# EAGLE design pi-dmx (EAGLE 7.3.0)

## Sheet 1 of 6
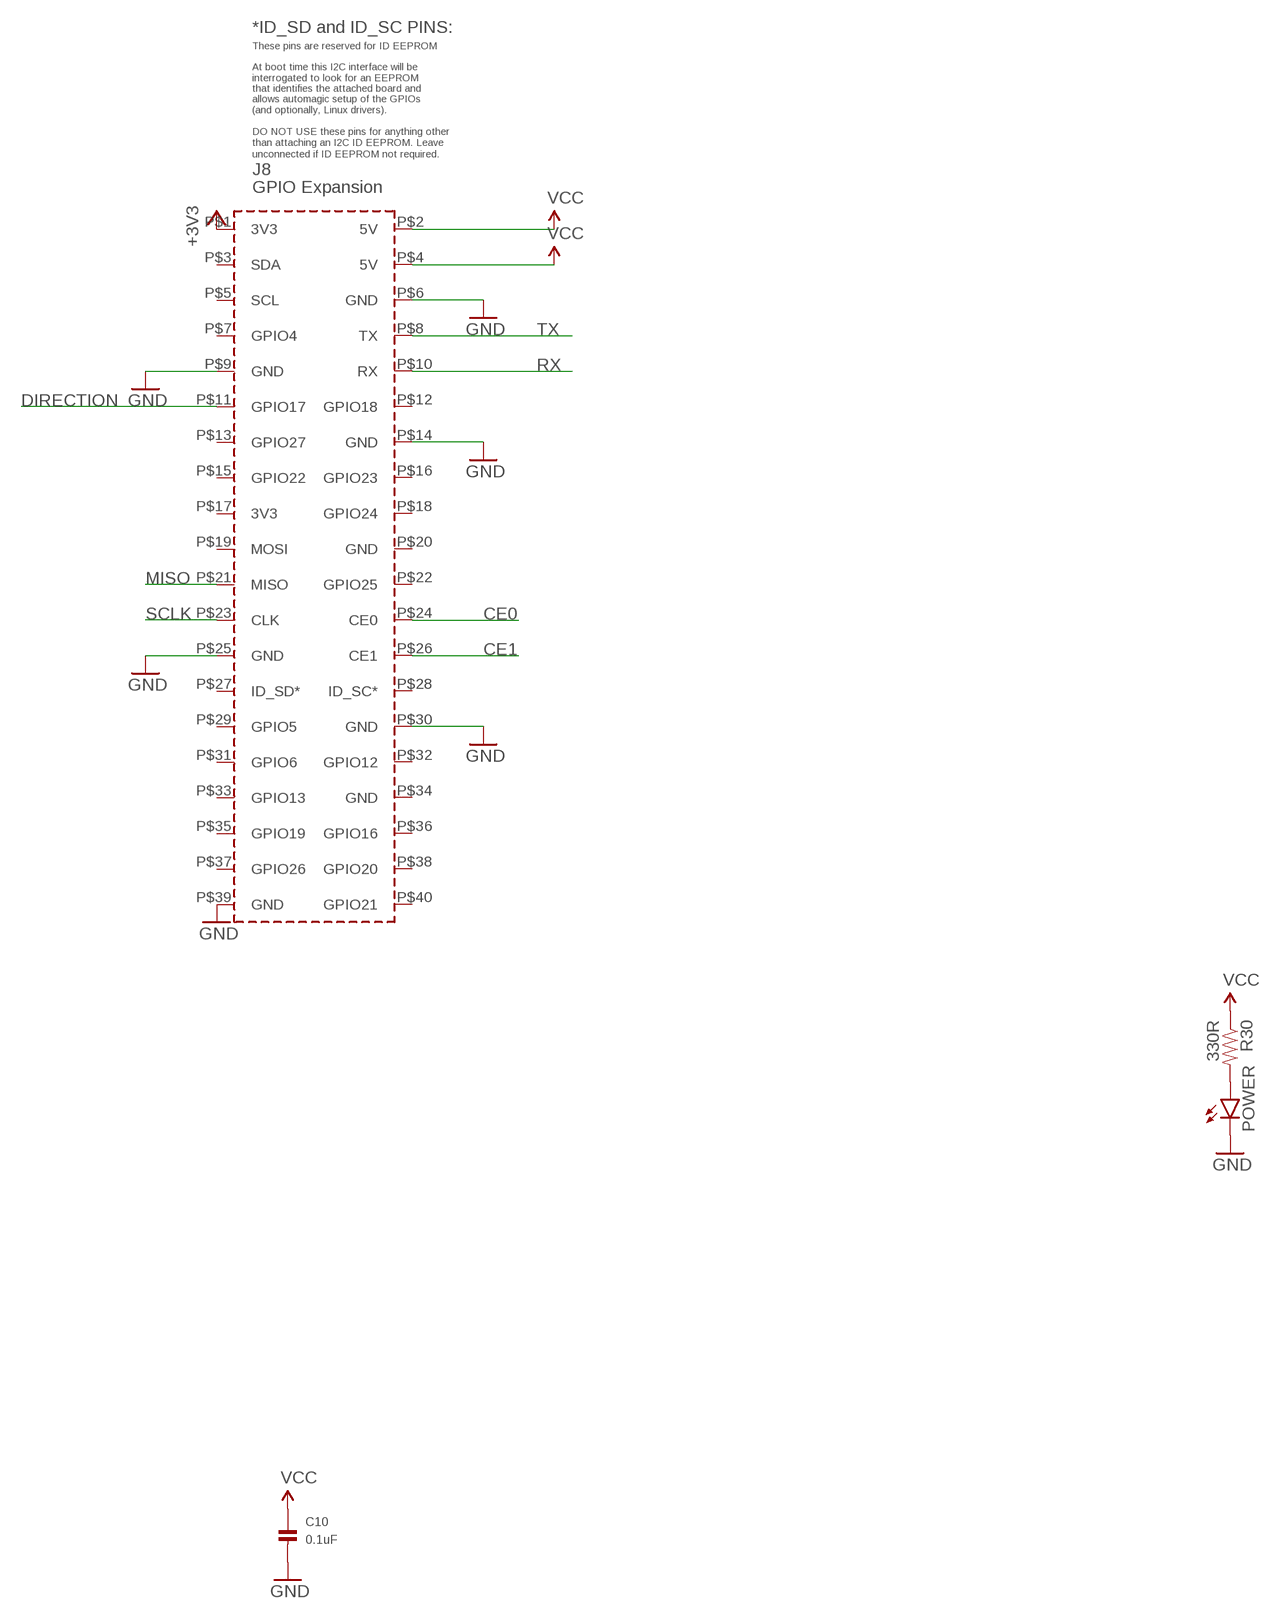
[diagram p0: schematic, sheet 1]

### Parts
C10  0.1uF  CAP_CERAMIC0805  [0805]
PCB1  RPI2  [RPI2]
POWER  LED1206  [LED-1206]
R30  330R  RESISTOR0603-RES  [0603-RES]

### Nets
+3V3: PCB1.P$1(3V3) ; also sheet 4
CE0: PCB1.P$24(CE0) ; also sheet 6
CE1: PCB1.P$26(CE1) ; also sheet 6
DIRECTION: PCB1.P$11(GPIO17) ; also sheet 4
GND: C10.2 PCB1.P$6(GND) PCB1.P$9(GND) PCB1.P$14(GND) PCB1.P$25(GND) PCB1.P$30(GND) PCB1.P$39(GND) POWER.C ; also sheet 2,4,6
MISO: PCB1.P$21(MISO) ; also sheet 6
N$30: POWER.A R30.2
RX: PCB1.P$10(RX) ; also sheet 4
SCLK: PCB1.P$23(CLK) ; also sheet 6
TX: PCB1.P$8(TX) ; also sheet 4
VCC: C10.1 PCB1.P$2(5V) PCB1.P$4(5V) R30.1 ; also sheet 2,4,6
Unconnected: PCB1.P$3(SDA) PCB1.P$5(SCL) PCB1.P$7(GPIO4) PCB1.P$12(GPIO18) PCB1.P$13(GPIO27) PCB1.P$15(GPIO22) PCB1.P$16(GPIO23) PCB1.P$17(3V3) PCB1.P$18(GPIO24) PCB1.P$19(MOSI) PCB1.P$20(GND) PCB1.P$22(GPIO25) PCB1.P$27(ID_SD*) PCB1.P$28(ID_SC*) PCB1.P$29(GPIO5) PCB1.P$31(GPIO6) PCB1.P$32(GPIO12) PCB1.P$33(GPIO13) PCB1.P$34(GND) PCB1.P$35(GPIO19) PCB1.P$36(GPIO16) PCB1.P$37(GPIO26) PCB1.P$38(GPIO20) PCB1.P$40(GPIO21)

## Sheet 2 of 6
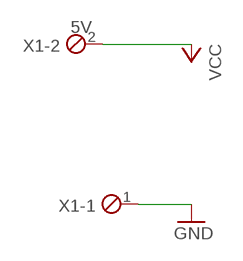
[diagram p1: schematic, sheet 2]

### Parts
X1  5V  MPT2  [2POL254]

### Nets
GND: X1.1 ; also sheet 1,4,6
VCC: X1.2 ; also sheet 1,4,6

## Sheet 3 of 6

## Sheet 4 of 6
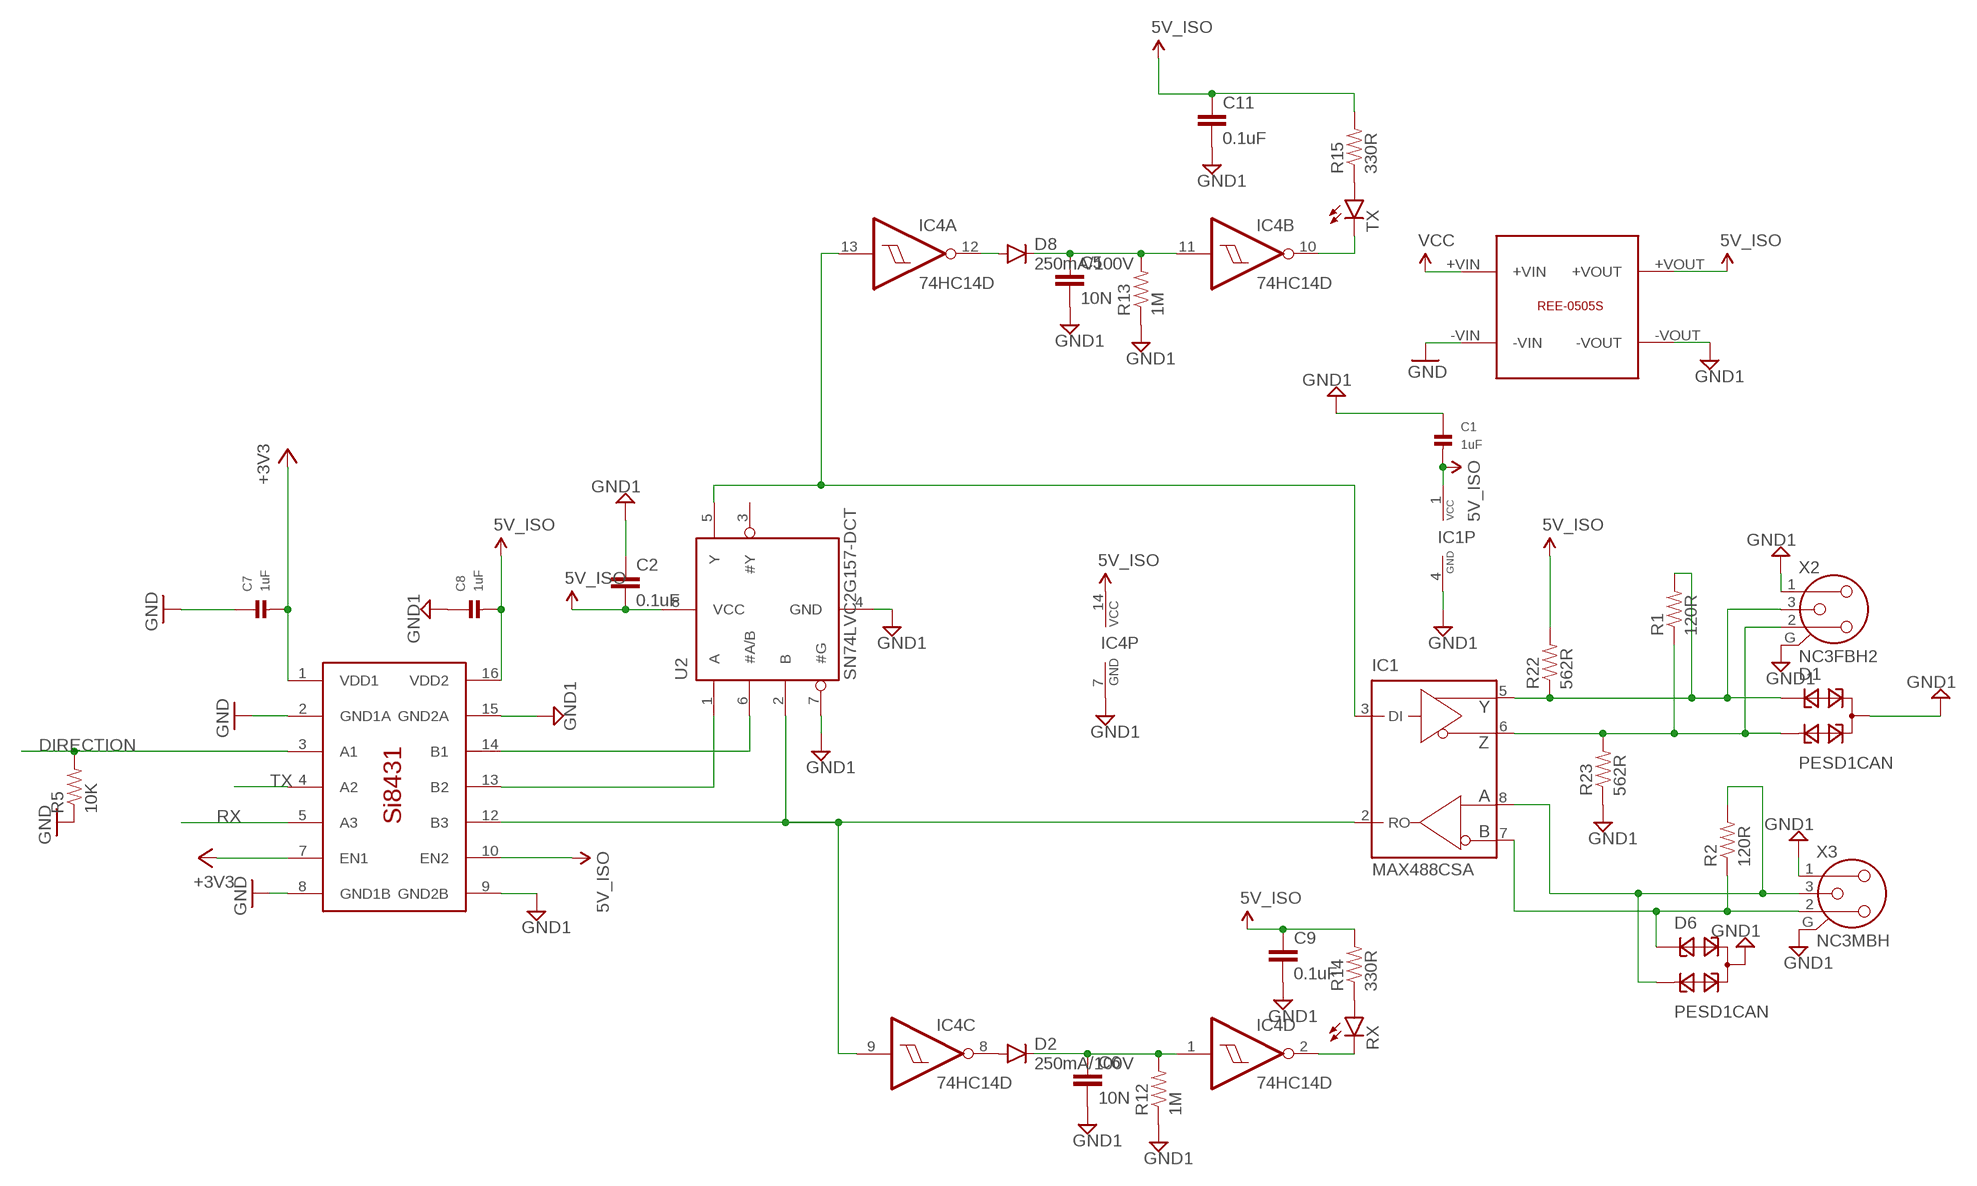
[diagram p2: schematic, sheet 4]

### Parts
C1  1uF  CAP_CERAMIC0805  [0805]
C2  0.1uF  CAP0603-CAP  [0603-CAP]
C5  10N  CAP0603-CAP  [0603-CAP]
C6  10N  CAP0603-CAP  [0603-CAP]
C7  1uF  CAP_CERAMIC0805  [0805]
C8  1uF  CAP_CERAMIC0805  [0805]
C9  0.1uF  CAP0603-CAP  [0603-CAP]
C11  0.1uF  CAP0603-CAP  [0603-CAP]
D1  PESD1CAN  [SOT23]
D2  250mA/100V  DIODEBAS16  [SOD-323]
D6  PESD1CAN  [SOT23]
D8  250mA/100V  DIODEBAS16  [SOD-323]
IC1  MAX488CSA  [SO08]
IC4  74HC14D  [SO14]
R1  120R  RESISTOR1206  [1206]
R2  120R  RESISTOR1206  [1206]
R5  10K  RESISTOR0603-RES  [0603-RES]
R12  1M  RESISTOR0603-RES  [0603-RES]
R13  1M  RESISTOR0603-RES  [0603-RES]
R14  330R  RESISTOR0603-RES  [0603-RES]
R15  330R  RESISTOR0603-RES  [0603-RES]
R22  562R  RESISTOR0603-RES  [0603-RES]
R23  562R  RESISTOR0603-RES  [0603-RES]
RX  LED1206  [LED-1206]
TX  LED1206  [LED-1206]
U2  SN74LVC2G157-DCT  [SSOP8]
U$6  REE-0505S  [REE-0505S]
U$8  SI8431  [SO16]
X2  NC3FBH2  [NC3FBH2]
X3  NC3MBH  [NC3MBH]

### Nets
5V: C1.2 C2.2 C8.2 C9.1 C11.1 IC1.1(VCC) IC4.14(P:VCC) R14.2 R15.2 R22.2 U2.8(VCC) U$6.+VOUT U$8.10(EN2) U$8.16(VDD2) ; supply symbol labelled 5V_ISO
+3V3: C7.2 U$8.1(VDD1) U$8.7(EN1) ; also sheet 1
DIRECTION: R5.2 U$8.3(A1) ; also sheet 1
GND: C7.1 R5.1 U$6.-VIN U$8.2(GND1A) U$8.8(GND1B) ; also sheet 1,2,6
GND1: C1.1 C2.1 C5.2 C6.2 C8.1 C9.2 C11.2 D1.3 D6.3 IC1.4(GND) IC4.7(P:GND) R12.1 R13.1 R23.1 U2.4(GND) U2.7(#G) U$6.-VOUT U$8.9(GND2B) U$8.15(GND2A) X2.1 X2.G X3.1 X3.G
N$1: D2.A IC4.8(C:O)
N$2: D8.A IC4.12(A:O)
N$3: D6.1 IC1.7(B) R2.1 X3.2
N$4: U2.6(#A/B) U$8.14(B1)
N$5: U2.1(A) U$8.13(B2)
N$6: D6.2 IC1.8(A) R2.2 X3.3
N$8: IC1.3(DI) IC4.13(A:I) U2.5(Y)
N$10: C5.1 D8.C IC4.11(B:I) R13.2
N$21: C6.1 D2.C IC4.1(D:I) R12.2
N$22: D1.1 IC1.5(Y) R1.2 R22.1 X2.3
N$23: D1.2 IC1.6(Z) R1.1 R23.2 X2.2
N$24: R14.1 RX.A
N$25: IC4.2(D:O) RX.C
N$26: R15.1 TX.A
N$27: IC4.10(B:O) TX.C
N$28: IC1.2(RO) IC4.9(C:I) U2.2(B) U$8.12(B3)
RX: U$8.5(A3) ; also sheet 1
TX: U$8.4(A2) ; also sheet 1
VCC: U$6.+VIN ; also sheet 1,2,6
Unconnected: IC4.3(E:I) IC4.4(E:O) IC4.5(F:I) IC4.6(F:O) U2.3(#Y)

## Sheet 5 of 6

## Sheet 6 of 6
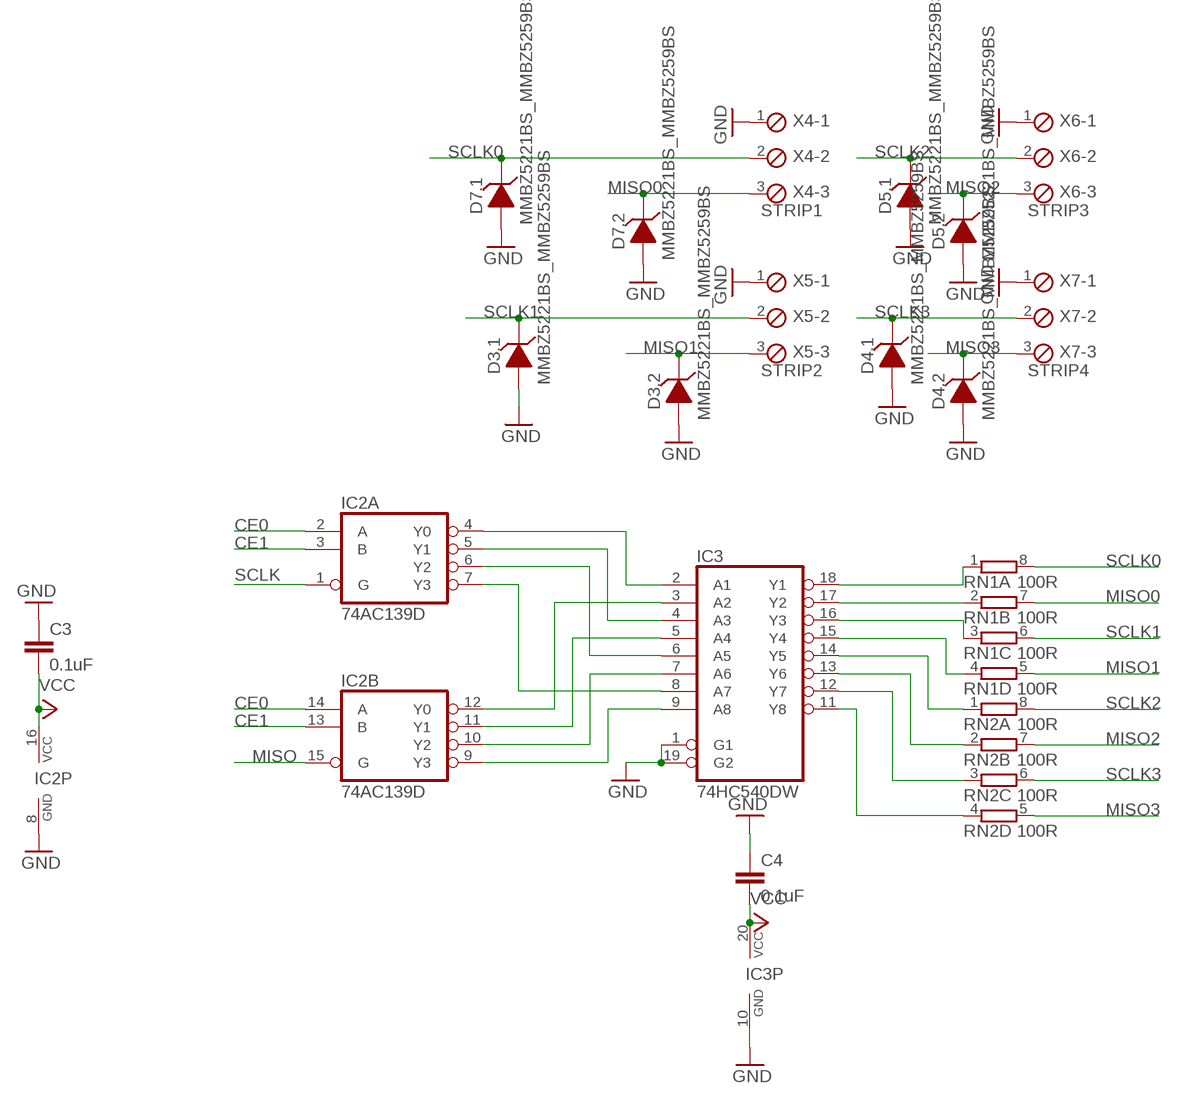
[diagram p3: schematic, sheet 6]

### Parts
C3  0.1uF  CAP0603-CAP  [0603-CAP]
C4  0.1uF  CAP0603-CAP  [0603-CAP]
D3  MMBZ5221BS_MMBZ5259BS  [SOT363_PHILIPS]
D4  MMBZ5221BS_MMBZ5259BS  [SOT363_PHILIPS]
D5  MMBZ5221BS_MMBZ5259BS  [SOT363_PHILIPS]
D7  MMBZ5221BS_MMBZ5259BS  [SOT363_PHILIPS]
IC2  74AC139D  [SO16]
IC3  74HC540DW  [SO20W]
RN1  100R  4R-NEXBS8V  [EXBS8V]
RN2  100R  4R-NEXBS8V  [EXBS8V]
X4  STRIP1  MPT3  [3POL254]
X5  STRIP2  MPT3  [3POL254]
X6  STRIP3  MPT3  [3POL254]
X7  STRIP4  MPT3  [3POL254]

### Nets
CE0: IC2.2(A:A) IC2.14(B:A) ; also sheet 1
CE1: IC2.3(A:B) IC2.13(B:B) ; also sheet 1
GND: C3.1 C4.1 D3.1(.1:A) D3.4(.2:A) D4.1(.1:A) D4.4(.2:A) D5.1(.1:A) D5.4(.2:A) D7.1(.1:A) D7.4(.2:A) IC2.8(P:GND) IC3.1(G1) IC3.10(GND) IC3.19(G2) X4.1 X5.1 X6.1 X7.1 ; also sheet 1,2,4
MISO: IC2.15(B:G) ; also sheet 1
MISO0: D7.3(.2:C) RN1.7 X4.3
MISO1: D3.3(.2:C) RN1.5 X5.3
MISO2: D5.3(.2:C) RN2.7 X6.3
MISO3: D4.3(.2:C) RN2.5 X7.3
N$7: IC3.17(Y2) RN1.2
N$9: IC3.18(Y1) RN1.1
N$11: IC3.16(Y3) RN1.3
N$12: IC3.15(Y4) RN1.4
N$13: IC2.4(A:Y0) IC3.2(A1)
N$14: IC2.5(A:Y1) IC3.4(A3)
N$15: IC2.6(A:Y2) IC3.6(A5)
N$16: IC2.7(A:Y3) IC3.8(A7)
N$17: IC2.12(B:Y0) IC3.3(A2)
N$18: IC2.11(B:Y1) IC3.5(A4)
N$19: IC2.10(B:Y2) IC3.7(A6)
N$20: IC2.9(B:Y3) IC3.9(A8)
N$32: IC3.14(Y5) RN2.1
N$33: IC3.13(Y6) RN2.2
N$34: IC3.12(Y7) RN2.3
N$35: IC3.11(Y8) RN2.4
SCLK: IC2.1(A:G) ; also sheet 1
SCLK0: D7.6(.1:C) RN1.8 X4.2
SCLK1: D3.6(.1:C) RN1.6 X5.2
SCLK2: D5.6(.1:C) RN2.8 X6.2
SCLK3: D4.6(.1:C) RN2.6 X7.2
VCC: C3.2 C4.2 IC2.16(P:VCC) IC3.20(VCC) ; also sheet 1,2,4

## Library data of the parts
C1 C7 C8 C10 = microbuilder:CAP_CERAMIC: Ceramic Capacitors 0402 - 0402 Surface Mount Capacitors 16pF 50V 5% [Digikey: 445-4899-2-ND] 18pF 50V 5% [Digikey: 490-1281-2-ND] 22pF 50V 5% [Digikey: 490-1283-2-ND] 68pF 50V 5% [Digikey: 490-1289-2-ND] 0.1uF 10V 10% [Digikey: 490-1318-2-ND] 1.0uF 6.3V 10% [Digikey: 490-1320-2-ND] 0603 - 0603 Surface Mount Capacitors 16 pF 50V 5% [Digikey: 445-5051-2-ND] 22 pF 50V [Digikey: PCC220ACVTR-ND] 33 pF 50V 5% [Digikey: 490-1415-1-ND] 56pF 50V 5% [Digikey: 490-1421-1-ND] 220pF 50V 5% [Digikey: 445-1285-1-ND] 680 pF 50V 2200 pF 50V 5% C0G [Digikey: 445-1297-1-ND] 5600 pF 100V 5% X7R [Digikey: 478-3711-1-ND] 0.1 µF 25V 10% [Digikey: PCC2277TR-ND] 0.22 µF 16V 10% X7R [Digikey: 445-1318-1-ND] 1.0 µF 25V 10% [Digikey: 445-5146-2-ND] 0603 - RF Specific 3pF 250V +/-0.1pF RF [Digikey: 712-1347-1-ND] 18 pF 250V 5% [Digikey: 478-3505-1-ND or 712-1322-1-ND] 56 pF 250V 5% C0G RF [Digikey: 490-4867-1-ND] 68 pF 250V RF [Digikey: 490-4868-1-ND] 0805 - 0805 Surface Mount Capacitors 220 pF 250V 2% RF Ceramic Capacitor [Digikey: 712-1398-1-ND] 1000 pF 50V 2% NP0 Ceramic Capacitor [Digikey: 478-3760-1-ND] 0.1 µF 25V 10% Ceramic Capacitor [Digikey: PCC1828TR-ND] 1.0 µF 16V 10% Ceramic Capacitor[Digikey: 490-1691-2-ND] 10.0 µF 10V 10% Ceramic Capacitor[Digikey: 709-1228-1-ND] 10.0 uF 16V 10% Ceramic Capacitor [Digikey: 478-5165-2-ND] 47 uF 6.3V 20% Ceramic Capacitor [Digikey: 587-1779-1-ND or 399-5506-1-ND] 1206 - 1206 Surface Mount Capacitors 47uF 10V 20% Ceramic Capacitor [Digikey: 490-5528-1-ND or 399-5508-1-ND or 445-6010-1-ND] 100uF 6.3V -20%, +80% Y5V Ceramic Capacitor (Digikey: 490-4512-1-ND, Mouser: 81-GRM31CF50J107ZE1L)
C2 = SparkFun-Passives:CAP: Capacitor Standard 0603 ceramic capacitor, and 0.1" leaded capacitor.
C3-C6 C9 C11 = SparkFun-Capacitors:CAP: Capacitor Standard 0603 ceramic capacitor, and 0.1" leaded capacitor.
D1 D6 = diode:PESD1CAN: CAN bus ESD protection diode Source: http://www.nxp.com/documents/data_sheet/PESD1CAN.pdf
D2 D8 = SparkFun-DiscreteSemi:DIODE: Diode These are standard reverse protection diodes and small signal diodes. SMA package can handle up to about 1A. SOD-323 can handle about 200mA. What the SOD-323 package when ordering, there are some mfgs out there that are 5-pin packages.; PROD_ID: DIO-09646
D3-D5 D7 = m-pad-2.1:MMBZ5221BS_MMBZ5259BS: Diodes Inc MMBZ5221BS - MMBZ5259BS 200mW SURFACE MOUNT ZENER DIODE Features: Planar Die Construction Dual Isolated Zeners in Ultra-Small Surface Mount Package Ideally Suited for Automated Assembly Processes Available in Lead Free/RoHS Compliant Version (Note 5) Please send any comments to: messi@users.sourceforge.net
IC1 = maxim:MAX488: RS485 TRANSEIVER Source: Data sheet <http://datasheets.maxim-ic.com/en/ds/MAX1487-MAX491.pdf>; MF: MAXIM; MPN: MAX488CSA; OC_FARNELL: 3534170; OC_NEWARK: 34C3921
IC2 = 74xx-eu:74*139: Dual 2-line to 4-line DECODER/DEMULTIPLEXER
IC3 = 74xx-eu:74*540: Octal BUFFER and LINE DRIVER, 3-state
IC4 = 74xx-eu:74*14: Hex schmitt trigger INVERTER
PCB1 = e14_Rpi2_RevA:RPI2: Device for Raspberry Pi 2 board created by www.element14.com More information and support community is available at http://www.element14.com/community/community/raspberry-pi/raspberrypi2
POWER RX TX = SparkFun-LED:LED: LEDs Standard schematic elements and footprints for 5mm, 3mm, 1206, and 0603 sized LEDs. 5mm - Spark Fun Electronics SKU : COM-00529 (and others)
R1 R2 R12-R15 = SparkFun-Resistors:RESISTOR: Resistor Basic schematic elements and footprints for 0603, 1206, and PTH resistors.
R5 R22 R23 R30 = SparkFun-Passives:RESISTOR: Resistor Basic schematic elements and footprints for 0603, 1206, and PTH resistors.
RN1 RN2 = resistor-dil:4R-N: Array Chip Resistor Source: RS Component / Phycomp; OC_FARNELL: unknown; OC_NEWARK: unknown
U2 = m-pad-2.1:SN74LVC2G157: Ti's SN74LVC2G157 SINGLE 2-LINE TO 1-LINE DATA SELECTOR/MULTIPLEXER Description: This single 2-line to 1-line data selector/multiplexer is designed for 1.65-V to 5.5-V VCC operation. The SN74LVC2G157 features a common strobe (G) input. When the strobe is high, Y is low and Y is high. When the strobe is low, a single bit is selected from one of two sources and is routed to the outputs. The device provides true and complementary data. NanoStar and NanoFree package technology is a major breakthrough in IC packaging concepts, using the die as the package. This device is fully specified for partial-power-down applications using Ioff. The Ioff circuitry disables the outputs, preventing damaging current backflow through the device when it is powered down. Features: Available in the Texas Instruments NanoStar and NanoFree Packages Supports 5-V VCC Operation Inputs Accept Voltages to 5.5 V Max tpd of 6 ns at 3.3 V Low Power Consumption, 10-uA Max ICC ±24-mA Output Drive at 3.3 V Typical VOLP (Output Ground Bounce) less then 0.8 V at VCC = 3.3 V, TA = 25°C Typical VOHV (Output VOH Undershoot) greater then 2 V at VCC = 3.3 V, TA = 25°C Ioff Supports Partial-Power-Down Mode Operation Latch-Up Performance Exceeds 100 mA Per JESD 78, Class II ESD Protection Exceeds JESD 22 - 2000-V Human-Body Model (A114-A) - 1000-V Charged-Device Model (C101) Please send any comments to: messi@users.sourceforge.net
U$6 = grant:REE-0505S
U$8 = smd-footprints:SI8431
X1 = con-phoenix-254:MPT2: PHOENIX CONNECTOR; OC_FARNELL: unknown; OC_NEWARK: unknown
X2 = con-neutrik_ag:NC3: Neutrik Audio Connector XLR SERIES Stereo 1/4" jack Source: www.neutrik.com/; MPN: NC3FBH2; OC_FARNELL: unknown; OC_NEWARK: 27B4226
X3 = con-neutrik_ag:NC3: Neutrik Audio Connector XLR SERIES Stereo 1/4" jack Source: www.neutrik.com/; MF: NEUTRIK; MPN: NC3MBH; OC_FARNELL: unknown; OC_NEWARK: 91F3470
X4-X7 = con-phoenix-254:MPT3: PHOENIX CONNECTOR; OC_FARNELL: unknown; OC_NEWARK: unknown

## Board
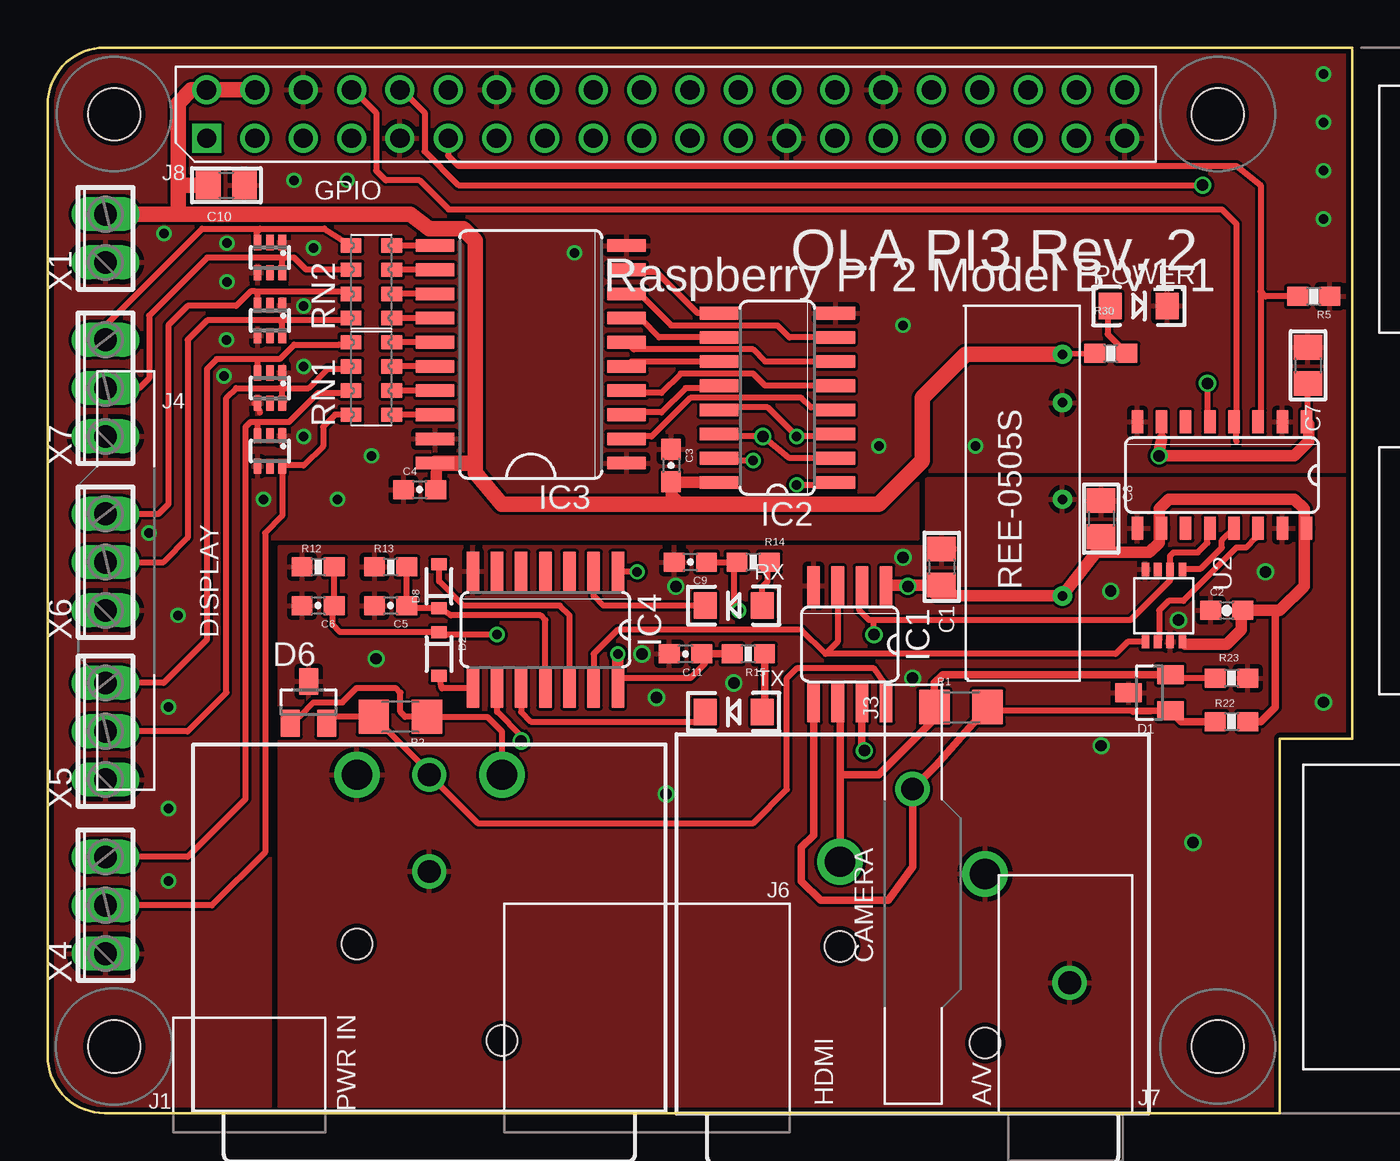
[diagram p4: board, top side]
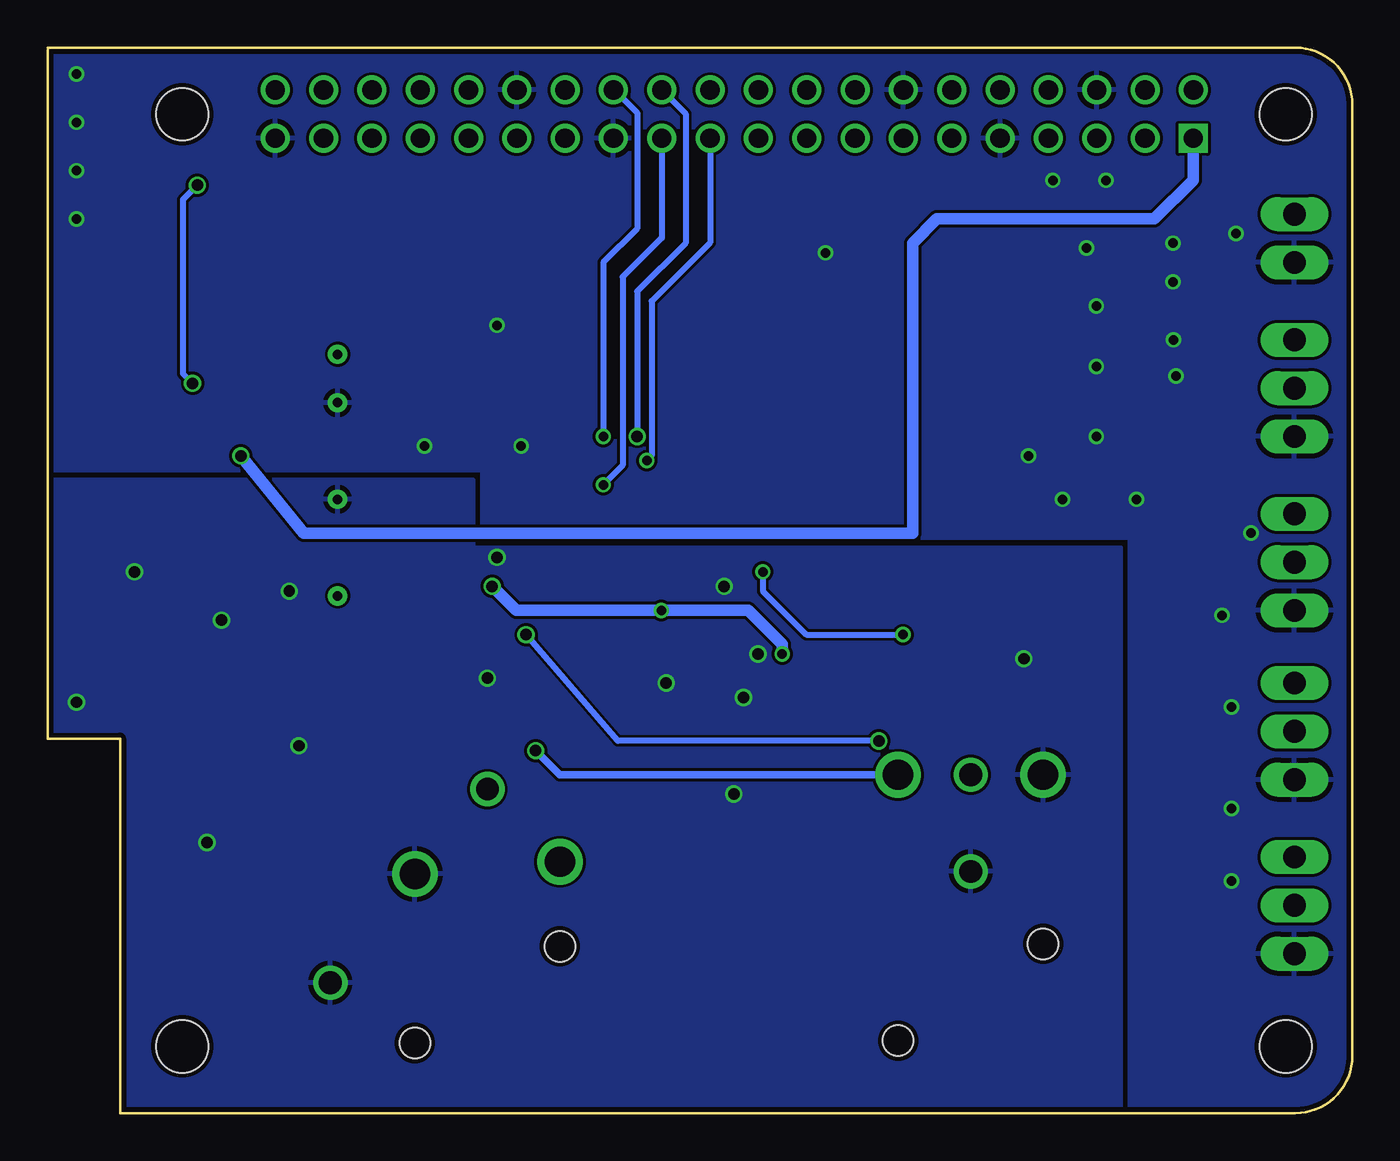
[diagram p5: board, bottom side, seen from below]

Size 68.58 x 56 mm. Coordinates in mm from the lower left corner, seen from the top.
Copper layers (1*16): Top 0.035mm / dielectric 1.5mm / Bottom 0.035mm
Design rules "SeeedStudio_2layer_DRU_no_angle_20140221": minimum track width 6mil, minimum drill 12mil, track to track 6mil, track to pad 6mil, pad to pad 6mil, via to via 6mil, smd to smd 0mil, copper to edge 10mil, drill to drill 10mil, minimum pad ring 10mil, minimum via ring 6mil, stop-mask expansion 2mil, vias tented up to drill 100mil, thermal gap 10mil

### Footprints (pad centres in the part's own frame; a part is rotated, then mirrored left to right if it is on the bottom)
0805 = smd 1.3 x 1.5: 1 -0.95,0; 2 0.95,0
0603-CAP = smd 1.1 x 1: 1 -0.85,0; 2 0.85,0
SOT23 = smd 1 x 1.4: 1 -0.95,-1.1; 2 0.95,-1.1; 3 0,1.1
SOD-323 = smd 0.63 x 0.83: A 1.15,0; C -1.15,0
SOT363_PHILIPS = smd 0.4 x 0.8: 1 -0.65,-0.8; 2 0,-0.8; 3 0.65,-0.8; 4 0.65,0.8; 5 0,0.8; 6 -0.65,0.8
SO08 = smd 0.66 x 2.032: 1 -1.905,-3.073; 2 -0.635,-3.073; 3 0.635,-3.073; 4 1.905,-3.073; 5 1.905,3.073; 6 0.635,3.073; 7 -0.635,3.073; 8 -1.905,3.073
SO16 = smd 0.66 x 2.032: 1 -4.445,-3.073; 2 -3.175,-3.073; 3 -1.905,-3.073; 4 -0.635,-3.073; 5 0.635,-3.073; 6 1.905,-3.073; 7 3.175,-3.073; 8 4.445,-3.073; 9 4.445,3.073; 10 3.175,3.073; 11 1.905,3.073; 12 0.635,3.073; 13 -0.635,3.073; 14 -1.905,3.073; 15 -3.175,3.073; 16 -4.445,3.073
SO20W = smd 0.66 x 2.032: 1 -5.715,-5.029; 2 -4.445,-5.029; 3 -3.175,-5.029; 4 -1.905,-5.029; 5 -0.635,-5.029; 6 0.635,-5.029; 7 1.905,-5.029; 8 3.175,-5.029; 9 4.445,-5.029; 10 5.715,-5.029; 11 5.715,5.029; 12 4.445,5.029; 13 3.175,5.029; 14 1.905,5.029; 15 0.635,5.029; 16 -0.635,5.029; 17 -1.905,5.029; 18 -3.175,5.029; 19 -4.445,5.029; 20 -5.715,5.029
SO14 = smd 0.66 x 2.032: 1 -3.81,-3.073; 2 -2.54,-3.073; 3 -1.27,-3.073; 4 0,-3.073; 5 1.27,-3.073; 6 2.54,-3.073; 7 3.81,-3.073; 8 3.81,3.073; 9 2.54,3.073; 10 1.27,3.073; 11 0,3.073; 12 -1.27,3.073; 13 -2.54,3.073; 14 -3.81,3.073
RPI2 = drill 1.016 square: P$1 8.37,51.23 | drill 1.016: P$2 8.357,53.772; P$3 10.897,51.232; P$4 10.897,53.772; P$5 13.437,51.232; P$6 13.437,53.772; P$7 15.977,51.232; P$8 15.977,53.772; P$9 18.517,51.232; P$10 18.517,53.772; P$11 21.057,51.232; P$12 21.057,53.772; P$13 23.597,51.232; P$14 23.597,53.772; P$15 26.137,51.232; P$16 26.137,53.772; P$17 28.677,51.232; P$18 28.677,53.772; P$19 31.217,51.232; P$20 31.217,53.772; P$21 33.757,51.232; P$22 33.757,53.772; P$23 36.297,51.232; P$24 36.297,53.772; P$25 38.837,51.232; P$26 38.837,53.772; P$27 41.377,51.232; P$28 41.377,53.772; P$29 43.917,51.232; P$30 43.917,53.772; P$31 46.457,51.232; P$32 46.457,53.772; P$33 48.997,51.232; P$34 48.997,53.772; P$35 51.537,51.232; P$36 51.537,53.772; P$37 54.077,51.232; P$38 54.077,53.772; P$39 56.617,51.232; P$40 56.617,53.772 | hole 2.75: 3.5,3.5; 61.5,3.5; 3.5,52.5; 61.5,52.5
LED-1206 = smd 1.2 x 1.4: A -1.5,0; C 1.5,0
1206 = smd 1.6 x 1.8: 1 -1.4,0; 2 1.4,0
0603-RES = smd 1.1 x 1: 1 -0.85,0; 2 0.85,0
EXBS8V = smd 0.75 x 1.1: 1 -1.905,-1.07; 2 -0.635,-1.07; 3 0.635,-1.07; 4 1.905,-1.07; 5 1.905,1.07; 6 0.635,1.07; 7 -0.635,1.07; 8 -1.905,1.07
SSOP8 = smd 0.4 x 0.7: 1 -0.975,-1.9; 2 -0.325,-1.9; 3 0.325,-1.9; 4 0.975,-1.9; 5 0.975,1.9; 6 0.325,1.9; 7 -0.325,1.9; 8 -0.975,1.9
REE-0505S = drill 0.5: +VIN 2.54,5.08; +VOUT 15.24,5.08; -VIN 5.08,5.08; -VOUT 10.16,5.08
SO16' = smd 0.6 x 1.2: 1 -4.445,-2.8; 2 -3.175,-2.8; 3 -1.905,-2.8; 4 -0.635,-2.8; 5 0.635,-2.8; 6 1.905,-2.8; 7 3.175,-2.8; 8 4.445,-2.8; 9 4.445,2.8; 10 3.175,2.8; 11 1.905,2.8; 12 0.635,2.8; 13 -0.635,2.8; 14 -1.905,2.8; 15 -3.175,2.8; 16 -4.445,2.8
2POL254 = drill 1.2 long: 1 -1.27,0; 2 1.27,0
NC3FBH2 = drill 1.6: 1 -3.81,0.635; 2 3.81,0 | drill 1.2: 3 0.004,-3.822; G -8.25,6.355 | hole 1.6: -3.81,9.525; 3.81,4.445
NC3MBH = drill 1.6: 1 3.81,0; 2 -3.81,0 | drill 1.2: 3 0,0; G 0,5.08 | hole 1.6: -3.81,13.97; 3.81,8.89
3POL254 = drill 1.2 long: 1 -2.54,0; 2 0,0; 3 2.54,0

### Placement (x,y rotation side)
C1  46.99,28.7 270 top
C2  61.98,26.42 0 top
C3  32.77,34.04 270 top
C4  19.56,32.77 0 top
C5  18.03,26.67 180 top
C6  14.22,26.67 180 top
C7  66.24,39.29 270 top
C8  55.37,31.24 270 top
C9  33.78,28.96 180 top
C10  9.4,48.77 0 top
C11  33.53,24.13 180 top
D1  57.91,22.1 90 top
D2  20.57,24.13 270 top
D3  11.68,38.1 180 top
D4  11.68,44.96 180 top
D5  11.68,41.66 180 top
D6  13.72,21.59 0 top
D7  11.68,34.8 180 top
D8  20.57,27.69 90 top
IC1  42.16,24.64 180 top
IC2  38.35,37.59 90 top
IC3  25.4,39.88 90 top
IC4  26.16,25.4 180 top
PCB1  0,0 0 top
POWER  57.35,42.42 0 top
R1  48.01,21.34 0 top
R2  18.54,20.83 180 top
R5  66.55,42.93 180 top
R12  14.22,28.7 0 top
R13  18.03,28.7 0 top
R14  37.08,28.96 180 top
R15  36.83,24.13 180 top
R22  62.23,20.57 0 top
R23  62.23,22.86 180 top
R30  55.88,39.93 0 top
RN1  17.02,38.61 90 top
RN2  17.02,43.69 90 top
RX  36.07,26.67 180 top
TX  36.07,21.08 180 top
U2  58.67,26.67 180 top
U$6  48.26,42.42 270 top
U$8  SI8431  [SO16']  61.72,33.53 180 top
X1  3.05,45.97 90 top
X2  45.47,13.21 180 top
X3  20.07,17.78 180 top
X4  3.05,10.92 90 top
X5  3.05,20.07 90 top
X6  3.05,28.96 90 top
X7  3.05,38.1 90 top

### Tracks (layer width: path | path; a pad name or v marks a point on that pad's centre or on a via)
5V  (via drill 0.5, 0.6)
  Top 0.305: IC1.1 44.07,28.57 | 59.78,24.64 U2.8 | v45.21,27.69 44.77,27.69 44.7,27.75 | R14.2 36.07,28.96 | C9.1 36.07,28.96 | 36.07,28.96 36.07,26.67 v36.32,26.42 | 34.54,24.13 34.54,23.62 33.78,22.86 29.97,22.86
  Top 0.406: R22.2 63.75,20.57 64.52,21.34 64.52,26.16 64.77,26.42 | C11.1 34.54,24.13 R15.2
  Top 0.61: C8.2 55.12,29.46 | 58.42,30.6 U$8.10 | 58.42,30.6 58.42,31.75 58.93,32.26 65.53,32.26 66.04,31.75 66.04,30.86 | 66.04,30.86 U$8.16 | 55.12,29.46 U$6.+VOUT 46.74,27.18 46.23,27.69 C1.2 44.7,27.75 44.11,27.75 IC1.1 | 58.42,30.6 58.42,29.97 57.91,29.46 55.12,29.46 | 59.78,24.64 61.98,24.64 62.74,25.4 62.74,26.33 C2.2 64.77,26.42 66.04,27.69 66.04,30.86 | v29.97,24.13 29.97,22.86 IC4.14
  Bottom 0.61: v45.21,27.69 43.94,26.42 v36.32,26.42 31.75,26.42 29.97,24.64 v29.97,24.13
+3V3  (via drill 0.6)
  Top 0.305: U$8.7 58.55,35.43 v58.42,34.54 | 66.29,36.2 U$8.1 66.18,36.31 C7.2
  Top 0.61: 66.29,36.2 66.29,35.31 65.53,34.54 v58.42,34.54 58.42,34.8 58.55,35.43
  Bottom 0.61: PCB1.P$1 8.37,49.03 10.41,46.99 21.84,46.99 23.11,45.72 23.11,30.48 55.12,30.48 v58.42,34.54
CE0  (via drill 0.6)
  Top 0.305: IC2.14 35.41,35.56 v37.59,35.56 38.99,34.42 IC2.2
  Bottom 0.305: PCB1.P$24 35.05,52.53 35.05,45.72 37.59,43.18 v37.59,35.56
CE1  (via drill 0.5)
  Top 0.305: IC2.3 41.3,35.56 v39.37,35.56 37.85,37.08 35.41,37.08 IC2.13
  Bottom 0.305: PCB1.P$26 38.79,53.77 37.59,52.58 37.59,46.48 39.37,44.7 v39.37,35.56
DIRECTION
  Top 0.305: PCB1.P$11 21.06,50.32 21.59,49.78 62.48,49.78 63.75,48.77 63.75,43.18 | 63.5,36.32 63.5,36.45 U$8.3 63.75,36.45 63.75,43.18 | R5.2 64.01,42.93 63.75,43.18
GND  (via drill 0.5)
  Top 0.305: D3.4 10.88,37.3 11.18,36.83
  other vias: 13.97,45.47 6.12,46.23 13.46,42.42 9.4,40.64 13.46,39.24 13.46,35.56 11.35,32.26 5.33,30.48 6.35,16 6.35,12.19 15.24,32.26 17.02,34.54 27.69,45.21 9.27,38.73 6.35,21.34 9.42,43.69 9.42,45.72 67.06,54.61 67.06,52.07 67.06,49.53 67.06,46.99 12.95,49.02 15.75,49.02 43.69,35.05 48.77,35.05 44.96,41.4 6.86,26.16
  pour Top: 0.25,0 11.68,0 11.68,30.23 45.72,30.23 45.72,33.78 68.83,33.78 68.83,55.88 0.25,55.88
  pour Bottom: 0.25,0 11.68,0 11.68,30.23 45.72,30.23 45.72,33.78 68.58,33.78 68.83,55.88 0.25,55.88
  pour Bottom: 0.25,0 11.68,0 11.68,30.23 45.72,30.23 45.72,33.78 68.58,33.78 68.83,55.88 0.25,55.88
  pour Bottom: 0.25,0 11.68,0 11.68,30.23 45.72,30.23 45.72,33.78 68.58,33.78 68.83,55.88 0.25,55.88
  pour Bottom: 0.25,0 11.68,0 11.68,30.23 45.72,30.23 45.72,33.78 68.58,33.78 68.83,55.88 0.25,55.88
GND1  (via drill 0.6)
  other vias: 32.51,16.76 45.47,22.86 55.37,19.3 55.88,27.43 67.06,21.59 60.2,14.22 44.96,29.21 64.01,28.45 59.44,25.91 17.27,23.88 33.02,27.69 32,21.84 31.24,24.13 36.07,22.61
  pour Top: 12.19,29.72 12.19,0 65.02,0 65.02,19.05 68.83,19.05 68.83,33.27 46.23,33.27 46.23,29.72
  pour Bottom: 12.19,29.72 12.19,0 65.02,0 65.02,19.05 68.83,19.05 68.83,33.27 46.23,33.27 46.23,29.72
MISO  (via drill 0.5)
  Top 0.305: v37.08,34.29 35.41,34.29 IC2.15
  Bottom 0.305: PCB1.P$21 33.76,45.74 36.83,42.67 36.83,34.54 v37.08,34.29
MISO0
  Top 0.305: 10.92,36.32 10.67,36.32 10.41,36.07 10.41,16.51 7.37,13.46 X4.3 | 10.92,36.32 12.7,36.32 14.22,37.85 15.31,37.85 RN1.7 | D7.3 11.03,36.21 10.92,36.32
MISO1
  Top 0.305: RN1.5 15.31,40.39 12.95,40.39 12.19,39.62 10.92,39.62 | 10.92,39.62 8.89,39.62 8.38,39.12 8.38,24.89 6.1,22.61 X5.3 | D3.3 11.03,39.51 10.92,39.62
MISO2
  Top 0.305: X6.3 5.84,31.5 6.35,32 6.35,41.4 7.37,42.42 9.91,42.42 10.67,43.18 10.92,43.18 | 10.92,43.18 15.31,43.18 RN2.7 | D5.3 11.03,43.07 10.92,43.18
MISO3
  Top 0.305: 11.18,46.48 8.13,46.48 3.05,41.4 X7.3 | 11.18,46.48 14.55,46.48 RN2.5 | D4.3 11,45.72 11,46.3 11.18,46.48
N$1
  Top 0.305: IC4.8 20.72,22.33 D2.A
N$2
  Top 0.305: D8.A 20.57,27.94 21.84,26.67 26.92,26.67 27.43,26.16 IC4.12
N$3  (via drill 0.6)
  Top 0.305: X3.2 23.88,20.07 23.11,20.83 R2.1 18.8,20.83 18.54,21.08 18.54,22.1 18.29,22.35 16.26,22.35 15.49,21.59 13.97,21.59 13.27,20.89 D6.1
  Top 0.406: IC1.7 42.8,19.18 v42.93,19.05
  Bottom 0.406: v42.93,19.05 41.66,17.78 X3.2
N$4
  Top 0.305: 63.75,30.6 U$8.14 63.5,30.6 63.5,30.23 62.99,29.72 62.48,29.72 59.69,26.92 58.93,26.92 58.42,26.42 58.42,24.84 U2.6
N$5
  Top 0.305: U2.1 59.69,28.61 60.62,28.61 61.72,29.72 61.72,30.09 U$8.13 62.48,30.6
N$6
  Top 0.305: 43.94,21.69 43.94,22.61 43.43,23.37 39.37,23.37 38.86,22.86 38.86,17.02 37.08,15.24 22.61,15.24 X3.3 20.07,17.9 R2.2 15,20.83 D6.2
  Top 0.406: 43.94,21.69 IC1.8
N$7
  Top 0.305: IC3.17 RN1.2
N$8
  Top 0.305: IC4.13 28.7,24.13 29.97,25.4 39.62,25.4 40.89,24.13 | U2.5 56.77,24.77 56.13,24.13 40.89,24.13 | IC1.3 41.53,24.77 40.89,24.13
N$9
  Top 0.305: IC3.18 RN1.1
N$10
  Top 0.305: R13.2 C5.1 19.02,26.54 D8.C 21.2,26.16 25.91,26.16 26.16,25.91 IC4.11
N$11
  Top 0.305: IC3.16 RN1.3
N$12
  Top 0.305: IC3.15 RN1.4
N$13
  Top 0.305: IC2.4 41.3,37.08 40.13,37.08 39.62,37.59 33.78,37.59 31.75,35.56 30.56,35.56 IC3.2 30.56,35.31
N$14
  Top 0.305: IC2.5 37.72,38.23 37.08,38.86 33.27,38.86 32.26,37.85 30.56,37.85 IC3.4
N$15
  Top 0.305: IC2.6 37.72,39.5 37.08,40.13 30.81,40.13 IC3.6
N$16
  Top 0.305: IC2.7 38.99,40.77 38.35,41.4 32.77,41.4 31.11,43.05 IC3.8
N$17
  Top 0.305: IC2.12 35.15,38.1 33.53,38.1 32.26,36.83 30.56,36.83 IC3.3 30.56,36.58
N$18
  Top 0.305: IC2.11 30.68,39.5 IC3.5
N$19
  Top 0.305: IC2.10 32.13,40.77 31.24,41.66 30.56,41.66 IC3.7
N$20
  Top 0.305: 30.56,44.45 IC3.9 30.56,44.2 32,44.2 34.16,42.04 IC2.9
N$21  (via drill 0.5)
  Top 0.305: IC4.1 30.96,28.47 v30.99,28.45 | v23.62,25.15 20.69,25.15 D2.C 15.36,25.28 14.99,25.65 14.99,26.58 C6.1 R12.2
  Bottom 0.305: v30.99,28.45 30.99,27.43 28.7,25.15 v23.62,25.15
N$22
  Top 0.305: 57.05,21.08 D1.1 49.59,21.15 R1.2
  Top 0.406: 40.13,21.69 IC1.5 40.26,14.61 39.62,13.97 39.62,12.19 40.64,11.18 44.2,11.18 45.47,12.95 X2.3 | 49.53,21.22 R1.2 49.22,21.15 46.68,18.25 X2.3 | X2.3 | R22.1 59.59,20.57 D1.1
N$23
  Top 0.305: R23.2 59.2,22.86 D1.2
  Top 0.406: 41.4,21.69 IC1.6 41.66,21.44 41.66,17.78 | 57,23.05 D1.2 47.05,23.05 46.61,22.61 R1.1 46.61,20.7 43.69,17.78 41.66,17.78 | X2.2 41.66,17.78
N$24
  Top 0.305: RX.A 37.57,27.66 37.85,27.94 37.85,29.12 R14.1
N$25
  Top 0.305: RX.C 29.21,26.67 28.7,27.18 IC4.2
N$26
  Top 0.406: TX.A 37.68,21.08 R15.1
N$27
  Top 0.305: IC4.10 24.89,21.08 25.4,20.57 34.06,20.57 TX.C
N$28  (via drill 0.6)
  Top 0.305: 43.43,25.91 56.9,25.91 59,28.01 U2.2 59,29.28 59.18,29.46 60.45,29.46 60.96,29.97 60.96,30.6 U$8.12 61.21,30.6 | 43.43,25.91 43.18,25.91 42.67,26.42 42.67,27.58 IC1.2 | v43.43,25.15 43.43,25.91 | v24.89,19.56 24.89,19.81 23.62,21.08 IC4.9
  Bottom 0.305: v24.89,19.56 38.61,19.56 v43.43,25.15
N$30
  Top 0.305: POWER.A 55.71,42.05 55.71,40.95 R30.2
N$32
  Top 0.305: IC3.14 RN2.1
N$33
  Top 0.305: IC3.13 RN2.2
N$34
  Top 0.305: IC3.12 RN2.3
N$35
  Top 0.305: IC3.11 RN2.4
RX  (via drill 0.6)
  Top 0.305: PCB1.P$10 18.62,53.77 19.81,52.58 19.81,50.55 21.59,48.77 v60.71,48.77 | v60.96,38.35 60.96,36.45 U$8.5
  Bottom 0.305: v60.71,48.77 61.47,48.01 61.47,38.86 v60.96,38.35
SCLK  (via drill 0.5)
  Top 0.305: v39.37,33.02 41.3,33.02 IC2.1
  Bottom 0.305: PCB1.P$23 36.3,46 38.35,43.94 38.35,34.04 v39.37,33.02
SCLK0
  Top 0.305: RN1.8 15.11,36.7 14.48,36.07 14.48,35.05 13.46,34.04 12.37,34.04 D7.6 12.33,31.38 11.43,30.48 11.43,13.72 8.64,10.92 X4.2
SCLK1
  Top 0.305: 12.19,38.1 9.91,38.1 9.4,37.59 9.4,22.1 7.37,20.07 X5.2 | 12.45,37.41 D3.6 | D3.6 12.33,37.96 12.19,38.1 | 12.37,37.34 D3.6 | 12.19,38.1 13.72,38.1 14.73,39.12 15.82,39.12 RN1.6
SCLK2
  Top 0.305: X6.2 6.1,28.96 7.37,30.23 7.37,40.64 8.38,41.66 12.19,41.66 | 12.19,41.66 15.82,41.66 RN2.8 | D5.6 12.33,41.51 12.19,41.66
SCLK3
  Top 0.305: X7.2 4.83,38.1 5.33,38.61 5.33,41.91 8.38,44.96 12.45,44.96 | RN2.6 13.59,44.32 12.95,44.96 12.45,44.96 | D4.6 12.33,44.85 12.45,44.96
TX
  Top 0.305: 62.48,36.45 U$8.4 62.48,36.2 | PCB1.P$8 16.08,53.77 17.27,52.58 17.27,49.53 17.78,49.02 19.56,49.02 21.08,47.5 61.72,47.5 62.48,46.74 62.48,36.2 | 62.48,35.31 62.48,36.2
VCC
  Top 0.305: U$6.+VIN 52.44,39.88 R30.1
  Top 0.61: C4.2 20.46,34.08 IC3.20 | IC2.16 32.78,33.15 | 32.78,33.15 C3.2 | 32.78,33.15 32.78,32.5 33.27,32
  Top 0.813: 6.86,48.77 6.86,53.09 7.54,53.77 PCB1.P$2 PCB1.P$4 | 6.86,48.77 6.86,47.24 | U$6.+VIN 48.26,39.88 45.97,37.59 45.97,34.29 43.69,32 33.27,32 23.88,32 22.48,33.66 22.48,34.16 | IC3.20 22.48,34.16 | 22.48,34.16 22.48,45.85 21.84,46.48 20.07,46.48 19.05,47.24 6.86,47.24 | 6.86,47.24 X1.2 | C10.1 6.86,48.77

### Text on the board
tNames: OLA PI3 Rev. 2